# Altium schematic sheet Sheet1.SchDoc
size A4; SheetNumber: 1; SheetTotal: 1; SPICEModelCacheFDUFBSJX: <root> / <DocumentId>FDUFBSJX</DocumentId> / <CacheFrame Number="0"> / <Model Name="iq" Kind="CKT"> / <Text>*** / *** / .SUBCKT IQ VCC VEE VIMON / EGNDF GNDF VEE VALUE = {0.5*V(VCC,VEE)} / GOUTP VCC GNDF VALUE = {IF(V(VIMON,VEE) &gt; 0, V(VIMON,VEE),0)} / GOUTN GNDF VEE VALUE = {IF(V(VIMON,VEE) &lt;= 0, V(VIMON,VEE),0)} / .ENDS</Text> / </Model> / <Model Name="driver" Kind="CKT"> / <Text>************ / ************ / .SUBCKT DRIVER Y Z D DE VCC GND / .PARAM VHRP0 = -0.5 / .PARAM VHRN0 = 0 / .PARAM ROUT = 10k / RIN D NMID 2.5e6 / EMID NMID GND VALUE = {0.5*V(VCC,GND)} / * TX enable / EDE NDE GND VALUE = {0.5*(1 + SGN(V(DE,GND) - V(NMID,GND)))} / * Convert input voltage to digital HI/LOW / EINLIM NINLIM GND VALUE = {0.5*(1 + SGN(V(D,GND) - V(NMID,GND)))} / EINLIMZ NINLIMZ GND VALUE = {0.5*(1 + SGN(V(NMID,GND) - V(D,GND)))} / * Output nodes voltage limits / EUL NUL GND VALUE = {V(VCC,GND) + VHRP0} / ELL NLL GND VALUE = {VHRN0} / ************* / EOUTY YINT GND VALUE = {MIN(MAX(V(VCC,GND)*V(NINLIM,GND),V(NLL,GND)),V(NUL,GND))} / EOUTZ ZINT GND VALUE = {MIN(MAX(V(VCC,GND)*V(NINLIMZ,GND),V(NLL,GND)),V(NUL,GND))} / *** / RYINT Y YINT 50 / RZINT Z ZINT 50 / .ENDS</Text> / </Model> / <Model Name="rx_sch_u2_s1" Kind="CKT"> / <Text>************ / ************ / .subckt RX_SCH_U2_S1 1 2 3 4 / S_U2_S1         3 4 1 2 _U2_S1 / RS_U2_S1         1 2 1G / .MODEL         _U2_S1 VSWITCH Roff=10e6 Ron=3 Voff=2.75V Von=2.25V / .ends RX_SCH_U2_S1</Text> / </Model> / <Model Name="dev_sch_h2" Kind="CKT"> / <Text>************ / ************ / .subckt DEV_SCH_H2 1 2 3 4 / H_H2         3 4 VH_H2 1 / VH_H2         1 2 0V / .ends DEV_SCH_H2</Text> / </Model> / <Model Name="driver_sch_u1_s2" Kind="CKT"> / <Text>************ / ************ / .subckt DRIVER_SCH_U1_S2 1 2 3 4 / S_U1_S2         3 4 1 2 _U1_S2 / RS_U1_S2         1 2 1G / .MODEL         _U1_S2 VSWITCH Roff=1e6 Ron=1 Voff=2.25V Von=2.75V / .ends DRIVER_SCH_U1_S2</Text> / </Model> / <Model Name="driver_sch_u1_s1" Kind="CKT"> / <Text>************ / ************ / .subckt DRIVER_SCH_U1_S1 1 2 3 4 / S_U1_S1         3 4 1 2 _U1_S1 / RS_U1_S1         1 2 1G / .MODEL         _U1_S1 VSWITCH Roff=1e6 Ron=1 Voff=2.25V Von=2.75V / .ends DRIVER_SCH_U1_S1</Text> / </Model> / <Model Name="dev_sch_h1" Kind="CKT"> / <Text>************ / ************ / .subckt DEV_SCH_H1 1 2 3 4 / H_H1         3 4 VH_H1 1 / VH_H1         1 2 0V / .ends DEV_SCH_H1</Text> / </Model> / <Model Name="dev_sch_h3" Kind="CKT"> / <Text>************ / ************ / .subckt DEV_SCH_H3 1 2 3 4 / H_H3         3 4 VH_H3 1 / VH_H3         1 2 0V / .ends DEV_SCH_H3</Text> / </Model> / <Model Name="comparator" Kind="CKT"> / <Text>************ / ************ / .SUBCKT COMPARATOR OUT INP INN VCC VEE / .PARAM VHR_VCC = -0.8 / .PARAM VHR_VEE = 0.1 / emid NMID 0 VALUE = {(V(VCC) + V(VEE))/2} / EOL NVOH VEE VALUE = {V(VCC,VEE) + VHR_VCC} / EOH NVOL VEE VALUE = {V(VEE) + VHR_VEE} / eout OUT VEE VALUE = {IF(V(INP,VEE) &gt;= V(INN,VEE),V(NVOH,VEE),V(NVOL,VEE))} / .ends</Text> / </Model> / <Model Name="sn65c1168e" Kind="CKT"> / <Text>* SN65C1168E / ***************************************************************************** / * (C) Copyright 2012 Texas Instruments Incorporated. All rights reserved. / ***************************************************************************** / ** This model is designed as an aid for customers of Texas Instruments. / ** TI and its licensors and suppliers make no warranties, either expressed / ** or implied, with respect to this model, including the warranties of / ** merchantability or fitness for a particular purpose.  The model is / ** provided solely on an "as is" basis.  The entire risk as to its quality / ** and performance is with the customer. / ***************************************************************************** / * / ** Released by: WEBENCH(R) Design Center, Texas Instruments Inc. / * Part: SN65C1168E / * Date: 0102/17/17 / * Model Type: All In One / * Simulator: TINA-TI / * Simulator Version: 9.3.150.4 SF-TI / * EVM Order Number: N/A / * EVM Users Guide: N/A / * Datasheet: SLLS740A - March 2007 - Revised April 2007 / * / * Model Version: 1.0 / * / ***************************************************************************** / * / * Updates: / * / * Version 1.0 : Release to Web / * / * / ***************************************************************************** / * Notes: / * 1. The model is intended to work with a 5V power supply / * 2. The driver low-level output voltage is higher than the published spec. / ***************************************************************************** / * / * / .SUBCKT SN65C1168E A B R D Y Z DE VCC GND / X_U3         VCC GND VIMON_Z IQ / E_U1_E1         U1_N04413 GND D GND 1 / X_U1_U1         U1_DRV_SUBCKT_Y U1_DRV_SUBCKT_Z U1_DIN DE VCC GND DRIVER / X_U1_S2    DE GND U1_DRV_SUBCKT_Z N01273 DRIVER_SCH_U1_S2 / C_U1_C1         GND U1_DIN  4p  TC=0,0 / R_U1_R1         U1_N04413 U1_DIN  1k TC=0,0 / X_U1_S1    DE GND U1_DRV_SUBCKT_Y N18476 DRIVER_SCH_U1_S1 / C_U1_C2         GND D  6p  TC=0,0 / X_U4         VCC GND VIMON_R IQ / X_H2    Z N01273 VIMON_Z GND DEV_SCH_H2 / X_H1    N18476 Y VIMON_Y GND DEV_SCH_H1 / X_H3    N19423 R VIMON_R GND DEV_SCH_H3 / X_U2         VCC GND VIMON_Y IQ / X_U2_S1    GND GND U2_OUT_COMP_WHYST N19423 RX_SCH_U2_S1 / R_U2_R6         U2_INP U2_OUT_COMP_WHYST  66.67k TC=0,0 / R_U2_R3         A GND  17k TC=0,0 / E_U2_E4         U2_IN_DEL U2_N30920 A B 1 / C_U2_C1         0 U2_OUT_DEL  200p  TC=0,0 / R_U2_R4         B GND  17k TC=0,0 / X_U2_U2         U2_OUT_COMP_WHYST U2_INP U2_N30752 VCC 0 COMPARATOR / R_U2_R7         GND GND  5e6 TC=0,0 / V_U2_V6         U2_N30752 GND 2.49556650246305Vdc / E_U2_E5         U2_IN_COMP_WHYST GND U2_OUT_DEL GND 1 / R_U2_R5         U2_IN_COMP_WHYST U2_INP  1k TC=0,0 / R_U2_R8         U2_IN_DEL U2_OUT_DEL  100 TC=0,0 / V_U2_V7         U2_N30920 GND 2.5Vdc / R_R1         GND VCC  1k TC=0,0 / .ENDS</Text> / <Dependency>0\iq</Dependency> / <Dependency>0\driver</Dependency> / <Dependency>0\rx_sch_u2_s1</Dependency> / <Dependency>0\dev_sch_h2</Dependency> / <Dependency>0\driver_sch_u1_s2</Dependency> / <Dependency>0\driver_sch_u1_s1</Dependency> / <Dependency>0\dev_sch_h1</Dependency> / <Dependency>0\dev_sch_h3</Dependency> / <Dependency>0\comparator</Dependency> / </Model> / </CacheFrame> / </root>
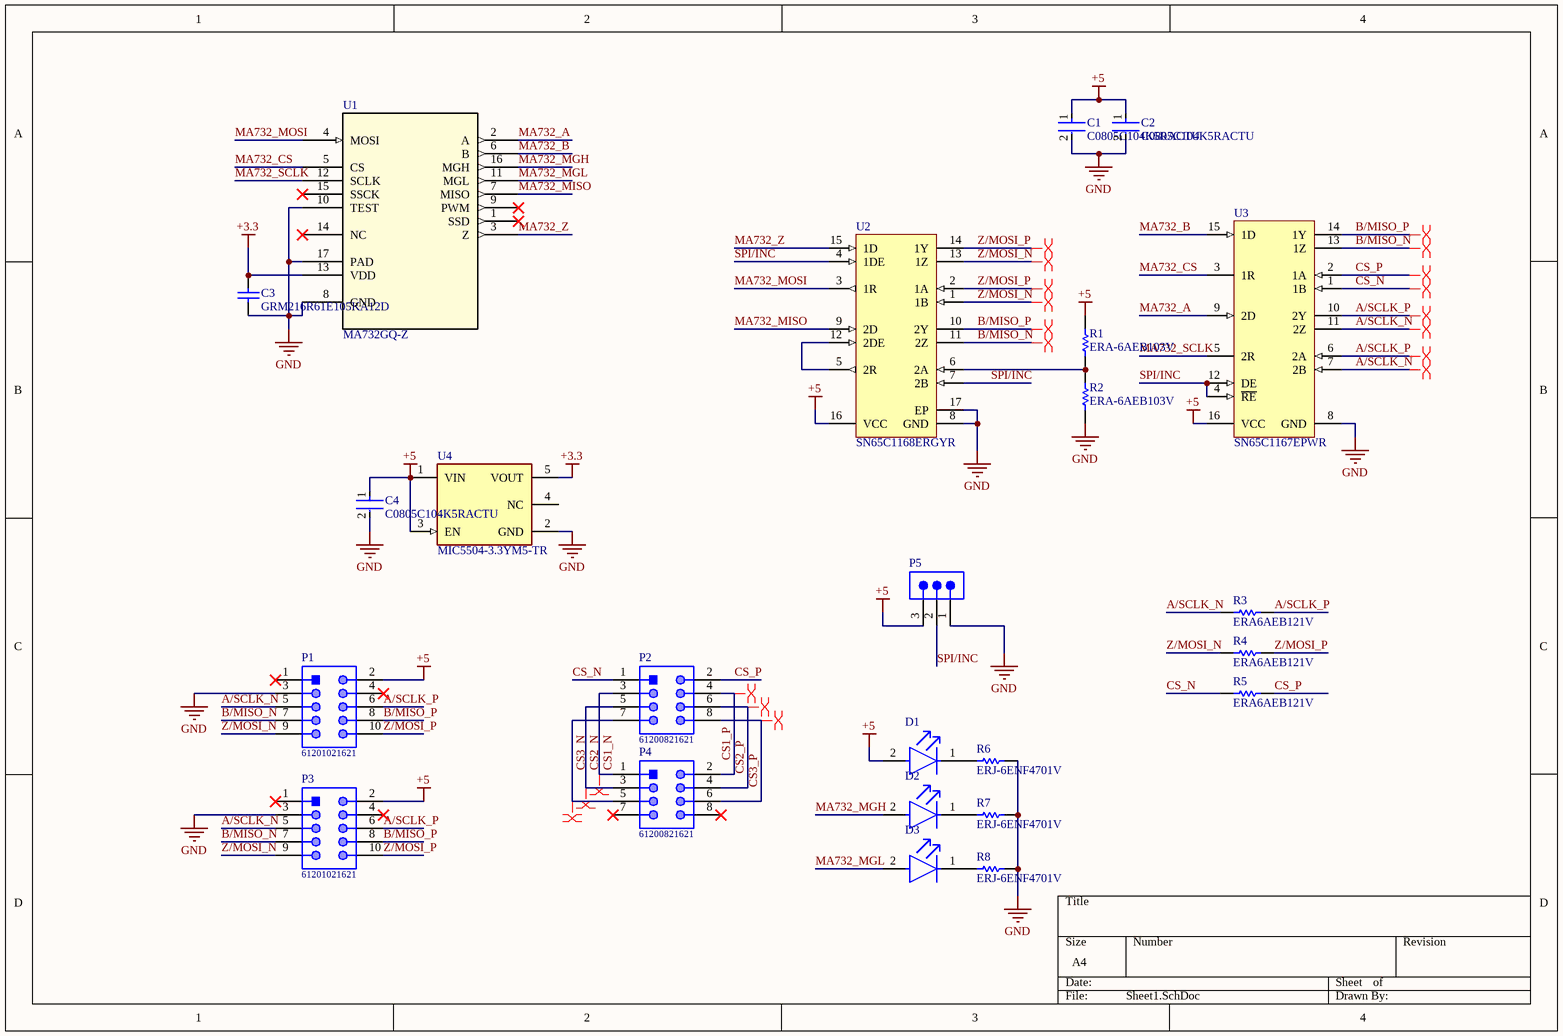
[diagram p0: Sheet1.SchDoc]

## Parts
C1  C0805C104K5RACTU  [FP-C0805C-DN-MFG]
C2  C0805C104K5RACTU  [FP-C0805C-DN-MFG]
C3  GRM216R61E105KA12D  [CAPC2013X70X45NL10T25]
C4  C0805C104K5RACTU  [FP-C0805C-DN-MFG]
D1  150080SS75000  [FP-150080SS75000-MFG]  (value not drawn)
D2  150080SS75000  [FP-150080SS75000-MFG]  (value not drawn)
D3  150080SS75000  [FP-150080SS75000-MFG]  (value not drawn)
P1  61201021621  [61201021621]
P2  61200821621  [61200821621]
P3  61201021621  [61201021621]
P4  61200821621  [61200821621]
P5  TSW-103-07-T-S  [SMTC-TSW-103-07-X-S]  (value not drawn)
R1  ERA-6AEB103V  [RESC2013X60X40LL20T25_A]
R2  ERA-6AEB103V  [RESC2013X60X40LL20T25_A]
R3  ERA6AEB121V  [RESC2013X60X40ML20T25]
R4  ERA6AEB121V  [RESC2013X60X40ML20T25]
R5  ERA6AEB121V  [RESC2013X60X40ML20T25]
R6  ERJ-6ENF4701V  [RESC2013X70X40NL20T20]
R7  ERJ-6ENF4701V  [RESC2013X70X40NL20T20]
R8  ERJ-6ENF4701V  [RESC2013X70X40NL20T20]
U1  MA732GQ-Z  [QFN-16_MA732]
U2  SN65C1168ERGYR  [RGY0016A_V]
U3  SN65C1167EPWR  [PW0016A_M]
U4  MIC5504-3.3YM5-TR  [FP-SOT23-5LD-PL-1-MFG]

## Nets
+3.3: C3.2 U1.13(VDD) U4.5(VOUT)
+5: C1.1 C2.1 C4.1 D1.2(A) P1.2 P3.2 P5.3 R1.2 U2.16(VCC) U3.16(VCC) U4.1(VIN) U4.3(EN)
GND: C1.2 C2.2 C3.1 C4.2 P1.3 P3.3 P5.1 R2.1 R6.2 R7.2 R8.2 U1.8(GND) U1.10(TEST) U1.17(PAD) U2.8(GND) U2.17(EP) U3.8(GND) U4.2(GND)
A/SCLK_N: P1.5 P3.5 R3.1 U3.7(2B) U3.11(2Z)
A/SCLK_P: P1.6 P3.6 R3.2 U3.6(2A) U3.10(2Y)
B/MISO_N: P1.7 P3.7 U2.11(2Z) U3.13(1Z)
B/MISO_P: P1.8 P3.8 U2.10(2Y) U3.14(1Y)
CS1_N: P2.3 P4.1
CS1_P: P2.4 P4.2
CS2_N: P2.5 P4.3
CS2_P: P2.6 P4.4
CS3_N: P2.7 P4.5
CS3_P: P2.8 P4.6
CS_N: P2.1 R5.1 U3.1(1B)
CS_P: P2.2 R5.2 U3.2(1A)
MA732_A: U1.2(A) U3.9(2D)
MA732_B: U1.6(B) U3.15(1D)
MA732_CS: U1.5(CS) U3.3(1R)
MA732_MGH: D2.2(A) U1.16(MGH)
MA732_MGL: D3.2(A) U1.11(MGL)
MA732_MISO: U1.7(MISO) U2.9(2D)
MA732_MOSI: U1.4(MOSI) U2.3(1R)
MA732_SCLK: U1.12(SCLK) U3.5(2R)
MA732_Z: U1.3(Z) U2.15(1D)
SPI/INC: P5.2 U2.4(1DE) U2.7(2B) U3.4(~{RE}) U3.12(DE)
Z/MOSI_N: P1.9 P3.9 R4.1 U2.1(1B) U2.13(1Z)
Z/MOSI_P: P1.10 P3.10 R4.2 U2.2(1A) U2.14(1Y)
NetD1_1: D1.1(C) R6.1
NetD2_1: D2.1(C) R7.1
NetD3_1: D3.1(C) R8.1
NetR1_1: R1.1 R2.2 U2.6(2A)
NetU2_5: U2.5(2R) U2.12(2DE)

Not connected (* = marked no-connect by the designer): P1 1* 4*; P3 1* 4*; P4 7* 8*; U1 1(SSD)* 9(PWM)* 14(NC)* 15(SSCK)*; U4 4(NC)

## Layout directives
differential pair: A/SCLK_N, A/SCLK_P, B/MISO_N, B/MISO_P, CS1_N, CS1_P, CS2_N, CS2_P, CS3_N, CS3_P, CS_N, CS_P, Z/MOSI_N, Z/MOSI_P

## Library data of the parts
C1 C2 C4 = CMP-2007-00279-2: CAP CER 0.1UF 50V X7R 0805; Manufacturer: KEMET; Value: 0.10 μF; Tolerance: 0.1; Temperature Coefficient: 30ppm/°C; Material: Ceramic; Description: C0805 0.10 μF X7R 30ppm/°C 10.00% 50 V; Manufacturer Part Number: C0805C104K5RACTU; Device Class L2: Capacitors; Temperature Range Low: -55°C; Voltage Rating: 50 V; Digikey Description: CAP CER 0.1UF 50V X7R 0805; Category: Cap; ComponentLink2Description: Datasheet; Octopart: https://octopart.com/c0805c104k5ractu-kemet-143926; RoHS: TRUE; ComponentLink2URL: https://content.kemet.com/datasheets/KEM_C1003_C0G_SMD.pdf; Temperature Characteristic: X7R; Temperature: -55°C to +125°C; Height: 0.88mm; Temperature Range High: +125°C; Device Class L1: Passive Components; Automotive: No; Lead Free: Yes; Ipc Land Pattern Name: CAPC200125X78; Device Class L3: Ceramic Capacitors; Mouser Description: Cap Ceramic 0.1uF 50V X7R 10% SMD 2.0 x 1.2 mm 125 C Paper T/R; Capacitance: 0.10 μF; Package: C0805C-DN
C3 = CMP-2007-00957-1: Manufacturer: Murata; Part Number: GRM216R61E105KA12D
D1-D3 = CMP-1426-00010-2: LED RED CLEAR 0805 SMD; Forward Voltage: 1.9V; Luminous Intensity: 60mcd; Dominant Wavelength: 630nm; Forward Current: 30mA; Viewing Angle: 140°; Lens Color: Colorless; Test Current: 20mA; Lens Size: 1.25mm; Packaging: Cut Tape; Width: 1.25mm; Case Code (Metric): 2012; Max Operating Temperature: 85°C; RoHS Compliant: Yes; Mount: Surface Mount; Case/Package: 0805; Series: WL-SMCW; Length: 2mm; Case Code (Imperial): 0805; Wavelength: 630nm; Lens Style: Clear; Min Operating Temperature: -40°C; Color: Red; Lens Transparency: Clear; Package Quantity: 1; Height: 0.8mm
P1 P3 = CMP-1502-00007-1: Male Box Header WR-BHD, THT, Vertical, pitch 2.54 mm, 10 pins; Manufacturer: Wurth Elektronik; Contact Resistance: 20mOhm; Withstanding Voltage: 500VAC; Pin Number: 10; Working Voltage: 250VAC; Pitch: 2.54mm; Mounting Technology: THT; Operating Temperature: -40to125degC; Published Date: August2018; Gender: Male; Packaging: Tray; Manufacturer URL: http://www.we-online.de; Datasheet URL: https://katalog.we-online.de/em/datasheet/6120xx21621.pdf; Orientation: Vertical; Package Reference: 61201021621; Part Number: 61201021621; Publisher: WurthElektronik
P2 P4 = CMP-1502-00006-1: Male Box Header WR-BHD, THT, Vertical, pitch 2.54 mm, 8 pins; Manufacturer: Wurth Elektronik; Working Voltage: 250VAC; Withstanding Voltage: 500VAC; Contact Resistance: 20mOhm; Pitch: 2.54mm; Pin Number: 8; Datasheet URL: https://katalog.we-online.de/em/datasheet/6120xx21621.pdf; Mounting Technology: THT; Publisher: WurthElektronik; Orientation: Vertical; Part Number: 61200821621; Operating Temperature: -40to125degC; Gender: Male; Packaging: Tray; Published Date: August2018; Package Reference: 61200821621; Manufacturer URL: http://www.we-online.de
P5 = CMP-1024-00332-1: 0.025" SQ Post Header, Through-hole, Vertical, -55 to 105 degC, 2.54 mm Pitch, 3-Pin, Male, RoHS; Manufacturer: Samtec; Pitch: 2.54 mm; ComponentLink1URL: http://www.samtec.com; ComponentLink3URL: http://www.samtec.com/documents/webfiles/cpdf/TSW-XXX-XX-XXX-X-XX-XXX-MKT.pdf; PartNumber: TSW-103-07-T-S; Mounting Technology: Through-hole; RoHS: True; DatasheetVersion: F-214; PackageVersion: DM, 8/1988; Temperature Range: -55 to 105 degC; ComponentLink2Description: Datasheet; ComponentLink1Description: Manufacturer URL; Orientation: Vertical; PackageReference: TSW-103-07-X-S; ComponentLink3Description: Package Specification; ComponentLink2URL: http://www.samtec.com/documents/webfiles/pdf/TSW_TH.PDF; PackageDescription: .025[0.64] SQ. Post Terminal Strip Assembly
R1 R2 = CMP-2001-00582-2: Metal Film Chip Resistor, High Reliability Type, 0.125 W, +/- 0.1%, -55 to 155 degC, 0805 (2012 Metric), RoHS, Tape and Reel; Voltage Rating: 100V; Power Rating: 125mW(1/8W); Brand: Panasonic; Temperature Coefficient: 25PPM/C; Resistance: 10kOhms; Product Category: ThinFilmResistors-SMD; Datasheet Version: 02/2016; Operating Temperature Range: -55Cto+155C; Length: 2mm; Mounting Technology: SurfaceMount; Manufacturer URL: http://www.panasonic.com/; Width: 1.25mm; Packaging: Reel; Product: ThinFilmResistorsSMD; Package / Case: 0805(2012metric); Termination Style: SMD/SMT; Tolerance: 0.1%; Datasheet URL: https://industrial.panasonic.com/cdbs/www-data/pdf/RDM0000/AOA0000C307.pdf; Package Description: 2-Pin Surface Mount Device, Body 2 x 1.25 mm; Factory Pack Quantity: 5000; Series: ERA-6A; Case Code - mm: 2012; RoHS: Details; Package Reference: 0805; Height: 0.5mm; Manufacturer: Panasonic; Case Code - in: 0805; Type: MetalFilmChipResistors
R3-R5 = CMP-2001-00588-1: Manufacturer: Panasonic; Part Number: ERA6AEB121V
R6-R8 = CMP-2001-00550-5: Chip Resistor, 4.7 KOhm, +/- 1%, 0.125 W, -55 to 155 degC, 0805 (2012 Metric), RoHS, Tape and Reel; Manufacturer: Panasonic; Voltage Rating: 150 V; Min Operating Temperature: -55 degC; PackageReference: 0805; Mounting Technology: Surface Mount; Height: 0.6 mm; PackageDescription: 2-Pin Surface Mount Device, Body 2 x 1.25 mm; RoHSCompliant: true; Length: 2 mm; REACH SVHC: Yes; Packaging: Tape and Reel; Pins: 2; Mount: Surface Mount; ComponentLink2Description: Datasheet; ComponentLink1URL: http://www.panasonic.com/; ComponentLink1Description: Manufacturer URL; DatasheetVersion: 04/2015; Package Quantity: 5000; ComponentLink2URL: http://industrial.panasonic.com/cdbs/www-data/pdf/RDA0000/AOA0000C86.pdf; Max Operating Temperature: 155 degC
U1 = MA732GQ-Z: No Description Available; Mfr_Name: Monolithic Power Systems; Copyright: Copyright (C) 2023 Ultra Librarian. All rights reserved.; Manufacturer_Part_Number: MA732GQ-Z; RefDes: RefDes; Type: DEV
U2 = CMP-0310-00131-3: None; Nominal Supply Current: 9mA; Number of Transmitters: 2; Data Rate: 10Mbps; Operating Supply Voltage: 5V; Logic Function: Transceiver; Max Supply Voltage: 5.5V; Propagation Delay: 8ns; Output Current: 20uA; Output Voltage: 3.5V; Min Supply Voltage: 4.5V; Number of Transceivers: 1; RoHS Compliant: Yes; Weight: 0.001312oz; Package Quantity: 1; Lead Free: Lead Free; Supply Current: 9mA; Number of Drivers: 2; Min Operating Temperature: -40°C; Series: -; Radiation Hardening: No; Number of Pins: 16; Number of Receivers: 2; Packaging: Tape and Reel; Max Operating Temperature: 85°C; Case/Package: VQFN EP; Operating Supply Current: 9mA
U3 = CMP-0310-00539-2: Dual Differential Driver and Receiver with +/-15-kV IEC ESD Protection, 2 TX / 2 RX, 5V, -40 to 85 degC, 16-Pin TSSOP(PW), Green (RoHS & no Sb/Br); Manufacturer: Texas Instruments; ESD(kV): 15; Supply Voltage(s)(V): 5; Receivers Per Package: 2; Rating: Catalog; SubFamily: RS-422; ICC(Max)(mA): 9; ComponentLink1Description: Datasheet; PackageVersion: revG, Feb-2011; PartNumber: SN65C1167EPWR; PackageDescription: 16-Pin Plastic Thin Small Outline Package 5 x 4.4 mm Body ,0.65 mm Pitch; DatasheetVersion: SLLS740A; Mounting Technology: Surface Mount; Eco-Plan: Green (RoHS & no Sb/Br); PackageReference: PW0016A; # of TX/RX: 2 TX / 2 RX; ComponentLink1URL: http://www.ti.com/general/docs/lit/getliterature.tsp?genericPartNumber=SN65C1167E&fileType=pdf; Footprint: MC34050; Drivers Per Package: 2; ComponentLink2Description: Package Specification; ComponentLink2URL: http://www.ti.com/lit/ml/mpds361/mpds361.pdf; Code_JEDEC: MO-153
U4 = CMP-2000-07604-2: IC REG LINEAR 3.3V 300MA SOT23-5; Quiescent Current: 38uA; Operating Supply Current: 42uA; Max Input Voltage: 5.5V; Min Input Voltage: 2.5V; Output Type: Fixed; Power Supply Rejection Ratio (PSRR): 60dB; Dropout Voltage: 380mV; Accuracy: 3%; Number of Outputs: 1; Nominal Output Voltage: 3.3V; Max Output Current: 300mA; Length: 2.9mm; Mount: Surface Mount; Width: 1.6mm; Packaging: Tape and Reel; Output Current: 300mA; Min Operating Temperature: -40°C; Max Operating Temperature: 125°C; Height: 1.1mm; Case/Package: SOT-23-5; REACH SVHC: No SVHC; Number of Pins: 5; Output Voltage: 3.3V